# EAGLE design PCA9955BTW (EAGLE 7.5.0)
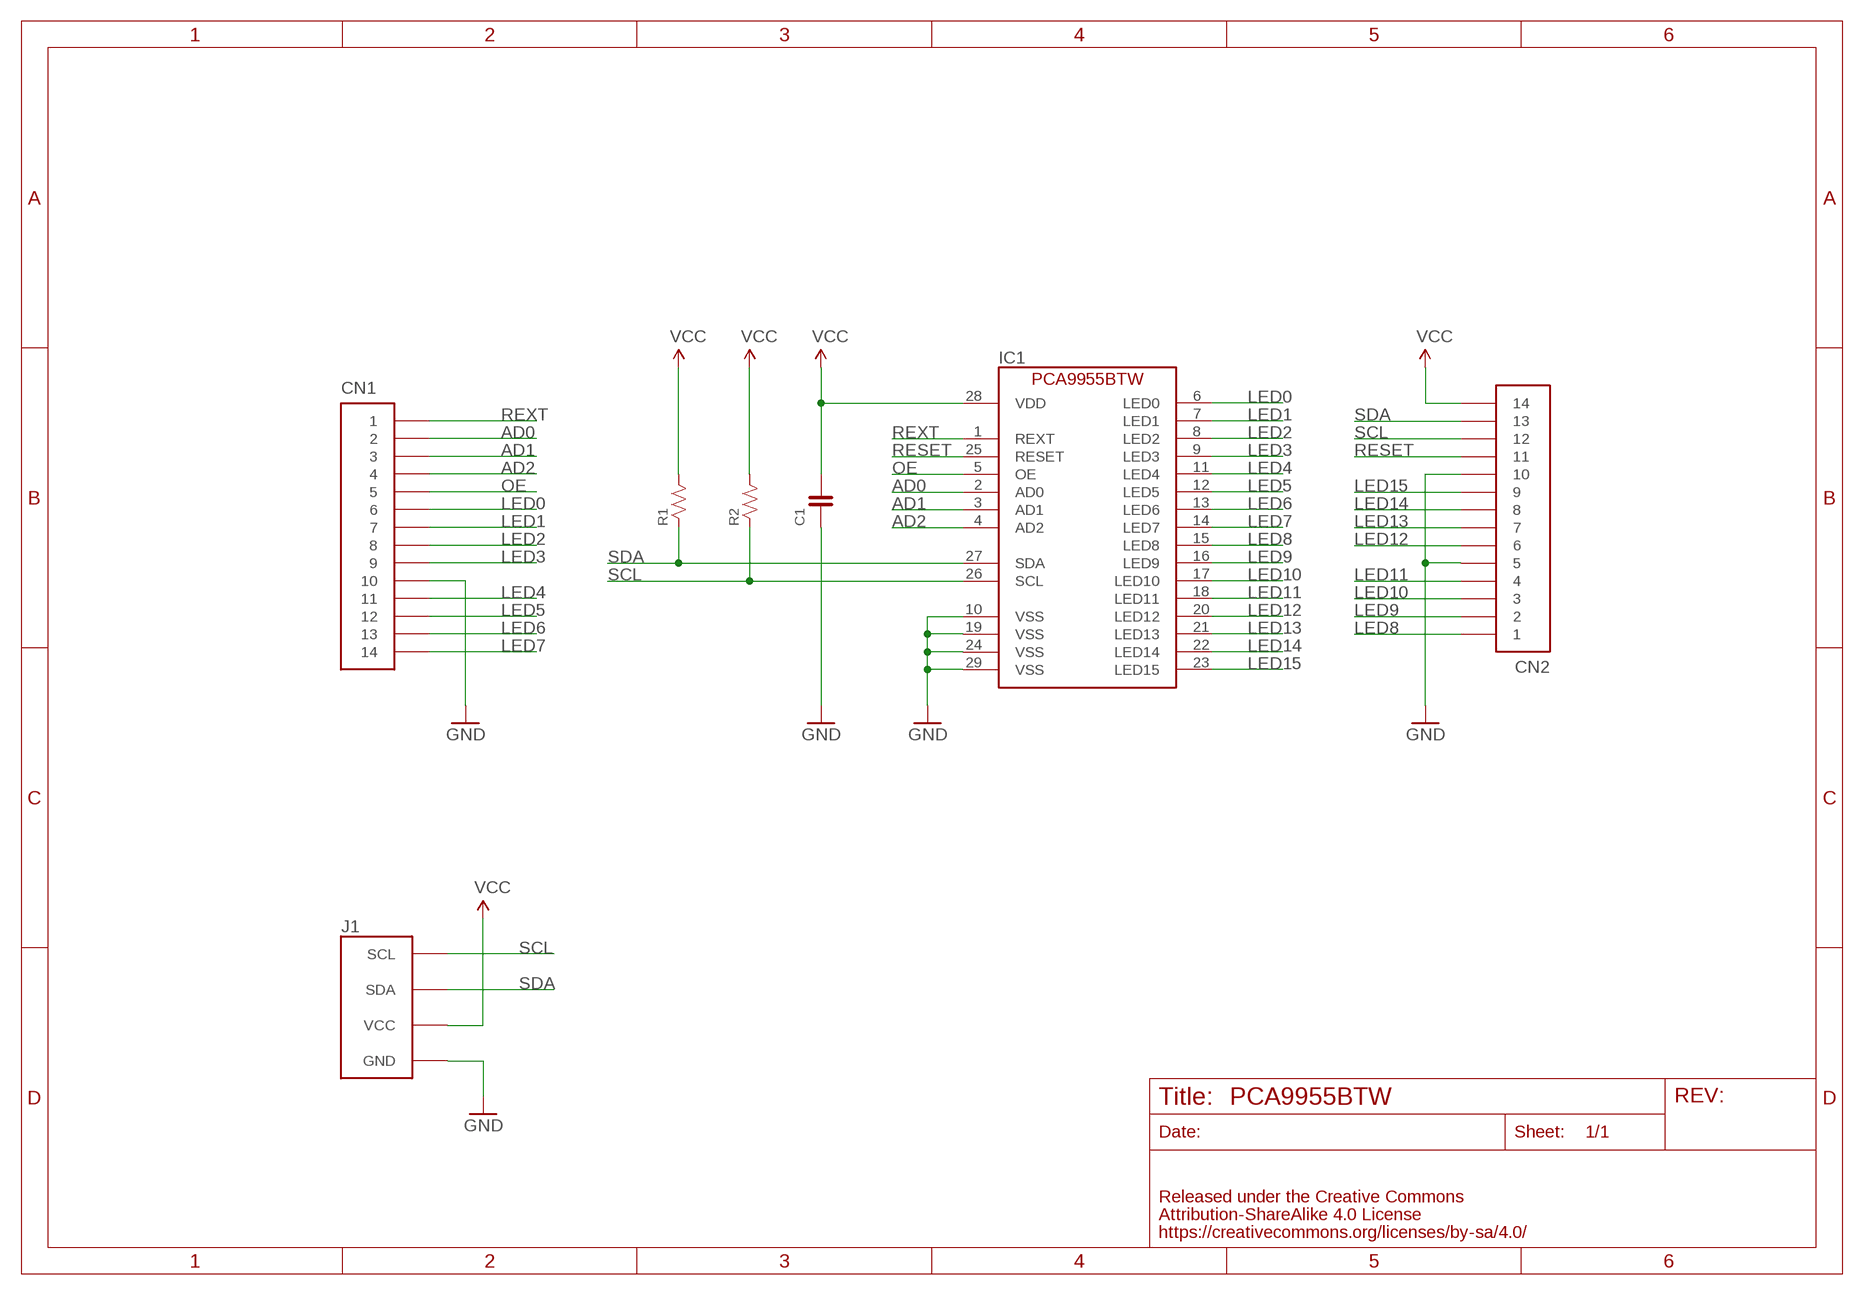
[diagram p0: schematic, sheet 1]

## Parts
C1  CAPACITOR-0603  [0603]
CN1  PIN_HEADER_1X14  [PIN_1X14_SNEAKY]
CN2  PIN_HEADER_1X14  [PIN_1X14_SNEAKY]
IC1  PCA9955BTW  [HTSSOP28]
J1  FABO_BRICK_I2C-CONNECTOR  [FABO_BRICK_I2C_CONNECTOR]
R1  RESISTOR-0603  [0603]
R2  RESISTOR-0603  [0603]

## Nets
AD0: CN1.2 IC1.2(AD0)
AD1: CN1.3 IC1.3(AD1)
AD2: CN1.4 IC1.4(AD2)
GND: C1.1 CN1.10 CN2.5 CN2.10 IC1.10(VSS) IC1.19(VSS) IC1.24(VSS) IC1.29(VSS) J1.GND
LED0: CN1.6 IC1.6(LED0)
LED1: CN1.7 IC1.7(LED1)
LED2: CN1.8 IC1.8(LED2)
LED3: CN1.9 IC1.9(LED3)
LED4: CN1.11 IC1.11(LED4)
LED5: CN1.12 IC1.12(LED5)
LED6: CN1.13 IC1.13(LED6)
LED7: CN1.14 IC1.14(LED7)
LED8: CN2.1 IC1.15(LED8)
LED9: CN2.2 IC1.16(LED9)
LED10: CN2.3 IC1.17(LED10)
LED11: CN2.4 IC1.18(LED11)
LED12: CN2.6 IC1.20(LED12)
LED13: CN2.7 IC1.21(LED13)
LED14: CN2.8 IC1.22(LED14)
LED15: CN2.9 IC1.23(LED15)
OE: CN1.5 IC1.5(OE)
RESET: CN2.11 IC1.25(RESET)
REXT: CN1.1 IC1.1(REXT)
SCL: CN2.12 IC1.26(SCL) J1.SCL R2.1
SDA: CN2.13 IC1.27(SDA) J1.SDA R1.1
VCC: C1.2 CN2.14 IC1.28(VDD) J1.VCC R1.2 R2.2

## Library data of the parts
C1 = FaBo-Capacitor:CAPACITOR: CAPACITOR
CN1 CN2 = FaBo-PIN:PIN_HEADER_1X14
IC1 = FaBo-LED:PCA9955BTW
J1 = FaBo-Template:FABO_BRICK_I2C: FaBo Brick I2C
R1 R2 = FaBo-Resistors:RESISTOR: RESISTOR

## Board
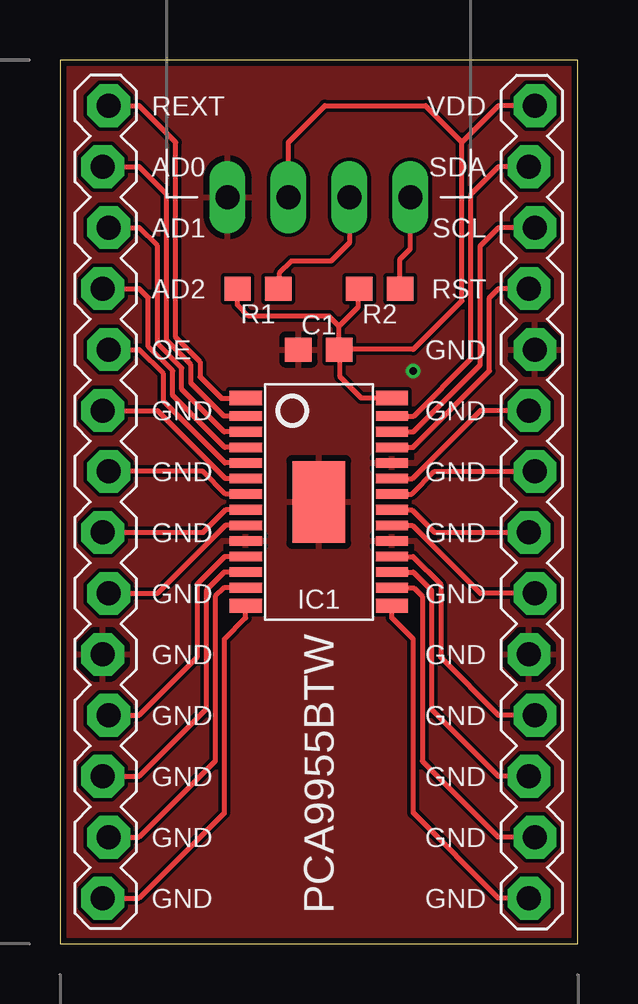
[diagram p1: board, top side]
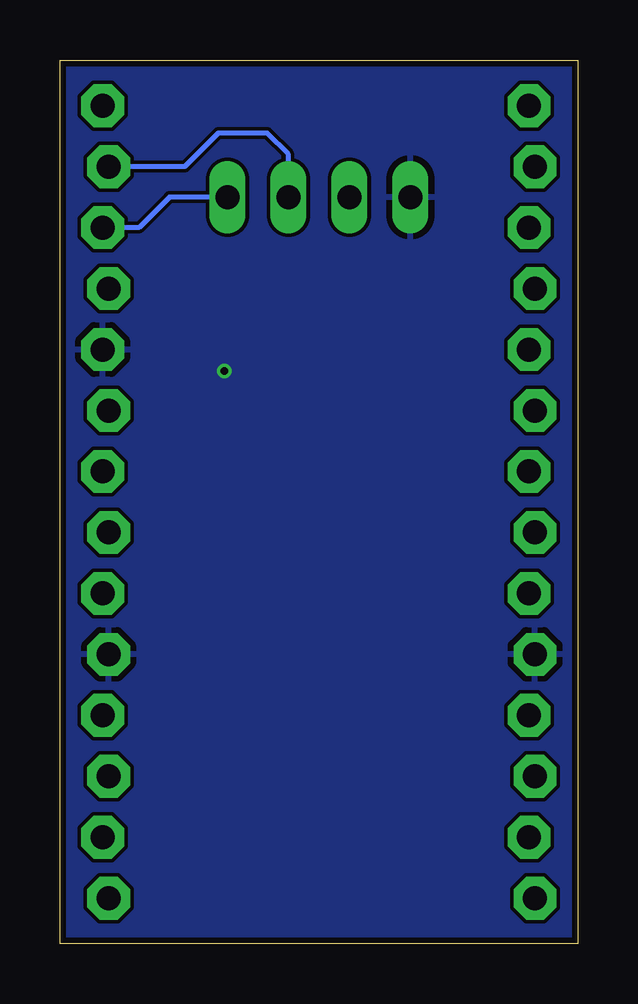
[diagram p2: board, bottom side, seen from below]

Size 21.59 x 36.83 mm. Coordinates in mm from the lower left corner, seen from the top.
Outline: 0,0 21.59,0 21.59,36.83 0,36.83 0,0
Copper layers (1*16): Top 0.035mm / dielectric 1.5mm / Bottom 0.035mm
Design rules "Elecrow_2-layer_eagle_rule": minimum track width 6mil, minimum drill 12mil, track to track 6mil, track to pad 6mil, pad to pad 6mil, via to via 6mil, smd to smd 0mil, copper to edge 10mil, drill to drill 10mil, minimum pad ring 10mil, minimum via ring 6mil, stop-mask expansion 2mil, vias tented up to drill 100mil, thermal gap 10mil

### Footprints (pad centres in the part's own frame; a part is rotated, then mirrored left to right if it is on the bottom)
0603 = smd 1.1 x 1: 1 -0.85,0; 2 0.85,0
PIN_1X14_SNEAKY = drill 1 pad 1.778 octagon: 1 -16.51,0.127; 2 -13.97,-0.127; 3 -11.43,0.127; 4 -8.89,-0.127; 5 -6.35,0.127; 6 -3.81,-0.127; 7 -1.27,0.127; 8 1.27,-0.127; 9 3.81,0.127; 10 6.35,-0.127; 11 8.89,0.127; 12 11.43,-0.127; 13 13.97,0.127; 14 16.51,-0.127
HTSSOP28 = smd 1.35 x 0.6: 1 -3.05,4.325; 14 -3.05,-4.325; 15 3.05,-4.325; 28 3.05,4.325 | smd 1.35 x 0.4: 2 -3.05,3.575; 3 -3.05,2.925; 4 -3.05,2.275; 5 -3.05,1.625; 6 -3.05,0.975; 7 -3.05,0.325; 8 -3.05,-0.325; 9 -3.05,-0.975; 10 -3.05,-1.625; 11 -3.05,-2.275; 12 -3.05,-2.925; 13 -3.05,-3.575; 16 3.05,-3.575; 17 3.05,-2.925; 18 3.05,-2.275; 19 3.05,-1.625; 20 3.05,-0.975; 21 3.05,-0.325; 22 3.05,0.325; 23 3.05,0.975; 24 3.05,1.625; 25 3.05,2.275; 26 3.05,2.925; 27 3.05,3.575 | smd 2.2 x 3.4: 29 0,0
FABO_BRICK_I2C_CONNECTOR = drill 1 long: GND -3.81,0; SCL 3.81,0; SDA 1.27,0; VCC -1.27,0

### Placement (x,y rotation side)
C1  10.79,24.77 0 top
CN1  1.91,18.41 270 top
CN2  19.68,18.41 90 top
IC1  10.79,18.41 0 top
J1  10.79,31.11 0 top
R1  8.26,27.3 180 top
R2  13.34,27.3 180 top

### Tracks (layer width: path | path; a pad name or v marks a point on that pad's centre or on a via)
AD0
  Top 0.203: CN1.2 3.3,32.38 4.45,31.24 4.45,25.15 5.46,24.13 5.46,23.37 6.84,21.99 IC1.2
AD1
  Top 0.203: CN1.3 3.3,29.84 4.06,29.08 4.06,25.02 5.08,24 5.08,23.11 6.85,21.34 IC1.3
AD2
  Top 0.203: CN1.4 3.3,27.3 3.68,26.92 3.68,24.89 4.7,23.88 4.7,22.86 6.87,20.69 IC1.4
GND  (via drill 0.3)
  other vias: 14.73,23.88
  pour Top: 0,0 21.59,0 21.59,36.83 0,36.83
  pour Bottom: 0,0 21.59,0 21.59,36.83 0,36.83
LED0
  Top 0.203: CN1.6 4.06,22.23 6.9,19.39 IC1.6
LED1
  Top 0.203: IC1.7 6.91,18.74 5.97,19.68 CN1.7
LED2
  Top 0.203: CN1.8 5.97,17.14 6.91,18.09 IC1.8
LED3
  Top 0.203: CN1.9 4.06,14.61 6.9,17.44 IC1.9
LED4
  Top 0.203: CN1.11 3.3,9.53 5.71,11.94 5.71,14.99 6.87,16.14 IC1.11
LED5
  Top 0.203: CN1.12 3.3,6.99 6.1,9.78 6.1,14.73 6.85,15.49 IC1.12
LED6
  Top 0.203: CN1.13 3.3,4.45 6.48,7.62 6.48,14.48 6.84,14.84 IC1.13
LED7
  Top 0.203: CN1.14 3.3,1.91 6.86,5.46 6.86,12.7 7.75,13.59 IC1.14
LED8
  Top 0.203: CN2.1 18.29,1.91 14.73,5.46 14.73,12.7 13.84,13.59 IC1.15
LED9
  Top 0.203: CN2.2 18.29,4.45 15.11,7.62 15.11,14.48 14.75,14.84 IC1.16
LED10
  Top 0.203: CN2.3 18.29,6.99 15.49,9.78 15.49,14.73 14.74,15.49 IC1.17
LED11
  Top 0.203: CN2.4 18.29,9.53 15.88,11.94 15.88,14.99 14.72,16.14 IC1.18
LED12
  Top 0.203: CN2.6 17.53,14.61 14.69,17.44 IC1.20
LED13
  Top 0.203: IC1.21 14.68,18.09 15.62,17.14 CN2.7
LED14
  Top 0.203: IC1.22 14.68,18.74 15.62,19.68 CN2.8
LED15
  Top 0.203: CN2.9 17.53,22.23 14.69,19.39 IC1.23
OE
  Top 0.203: CN1.5 3.3,24.77 4.32,23.75 4.32,22.61 6.88,20.04 IC1.5
RESET
  Top 0.203: CN2.11 18.29,27.3 17.91,26.92 17.91,23.88 14.72,20.69 IC1.25
REXT
  Top 0.203: CN1.1 3.3,34.92 4.83,33.4 4.83,25.27 5.84,24.26 5.84,23.62 6.73,22.73 7.74,22.73 IC1.1
SCL
  Top 0.203: CN2.12 18.29,29.84 17.53,29.08 17.53,24.13 14.74,21.34 IC1.26 | R2.1 14.19,28.54 14.61,28.96 J1.SCL
  Bottom 0.203: J1.SCL 17.02,31.11 18.29,29.84 CN2.12
SDA
  Top 0.203: CN2.13 18.29,32.38 17.14,31.24 17.14,24.38 14.75,21.99 IC1.27 | J1.SDA 12.06,29.21 11.3,28.45 9.65,28.45 9.14,27.94 9.14,27.34 R1.1
  Bottom 0.203: J1.SDA 12.06,32.89 12.95,33.78 14.99,33.78 16.38,32.38 CN2.13
VCC
  Top 0.203: CN2.14 18.29,34.92 16.76,33.4 | IC1.28 12.57,22.74 11.68,23.62 11.68,24.73 C1.2 | 16.76,33.4 16.76,26.8 14.74,24.77 C1.2 | C1.2 11.64,25.74 | 11.64,25.74 12.45,26.54 12.45,27.27 R2.2 | 11.64,25.74 11.22,26.16 7.87,26.16 7.41,26.63 R1.2 | J1.VCC 9.53,33.4 11.05,34.92 15.24,34.92 16.76,33.4

### Text on the board
tPlace: REXT | VDD | AD0 | SDA | AD1 | SCL | AD2 | RST | OE | GND | GND | GND | GND | GND | GND | GND | GND | GND | GND | GND | GND | GND | GND | GND | GND | GND | GND | GND | PCA9955BTW